# EAGLE design dhtsensor (EAGLE 6.1)
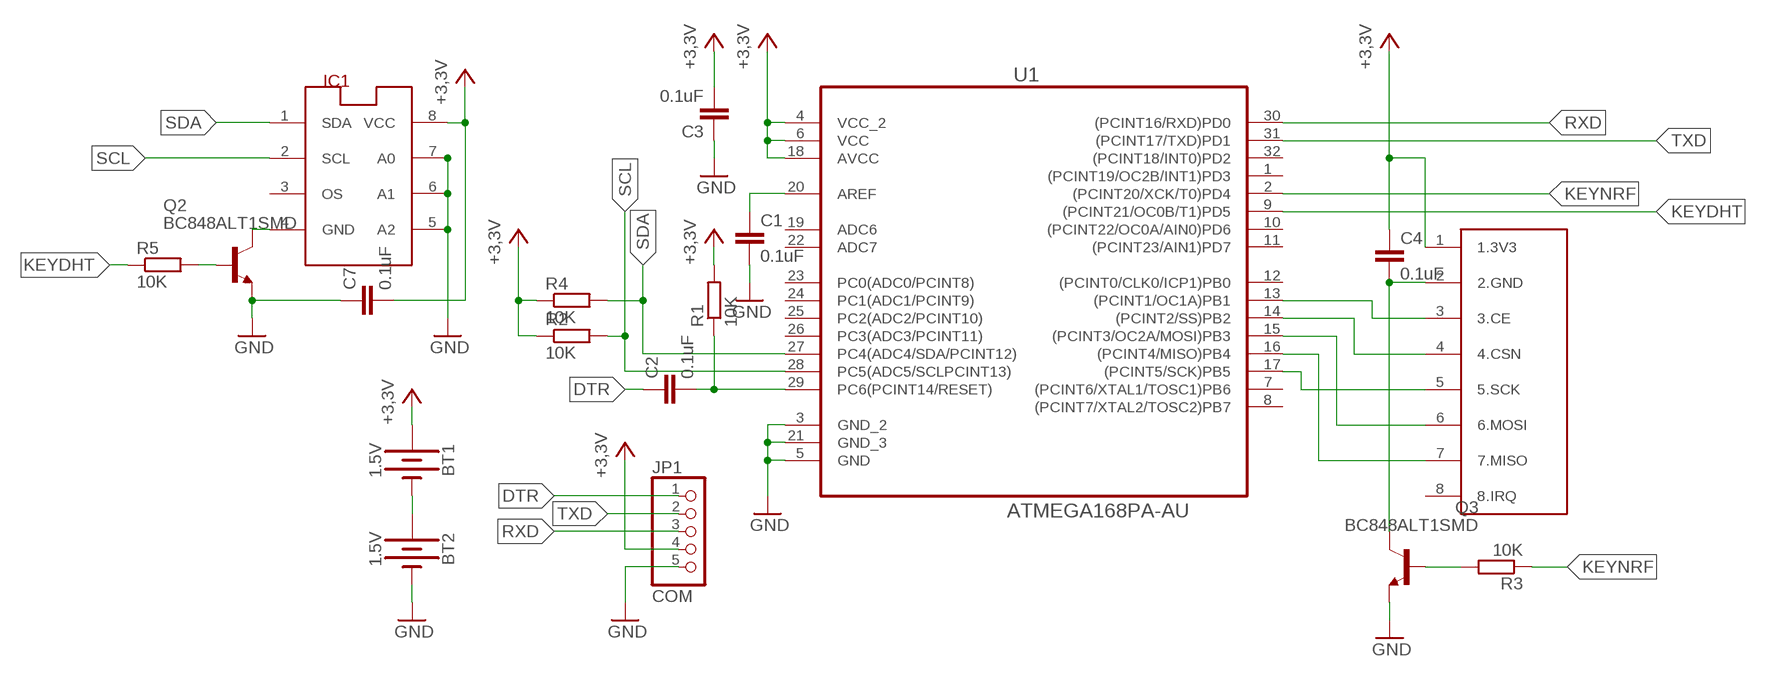
[diagram p0: schematic, sheet 1]

## Parts
BT1  1.5V  BATTERY-AAA_KIT  [BATTERY-AAA-KIT]
BT2  1.5V  BATTERY-AAA_KIT  [BATTERY-AAA-KIT]
C1  0.1uF  C-EUC1206  [C1206]
C2  0.1uF  C-EUC1206  [C1206]
C3  0.1uF  C-EUC1206  [C1206]
C4  0.1uF  C-EUC1206  [C1206]
C7  0.1uF  C-EUC1206  [C1206]
IC1  LM75_ICN  [SO8_LM75]
JP1  COM  PINHD-1X5  [1X05]
Q2  BC848ALT1SMD  [SOT23]
Q3  BC848ALT1SMD  [SOT23]
R1  10K  R-EU_R1206  [R1206]
R2  10K  R-EU_R1206  [R1206]
R3  10K  R-EU_R1206  [R1206]
R4  10K  R-EU_R1206  [R1206]
R5  10K  R-EU_R1206  [R1206]
U1  ATMEGA168PA-AU  [QFP80P900X900X120-32N]
U$9  NRF24L01+  [NRF24L01+]

## Nets
+3,3V: BT1.PWR@1(+) C3.2 C4.1 C7.2 IC1.8(VCC) JP1.4 R1.2 R2.1 R4.1 U1.4(VCC_2) U1.6(VCC) U1.18(AVCC) U$9.1(1.3V3)
DTR: C2.1 JP1.1
GND: BT2.GND@1(-) C1.2 C3.1 C7.1 IC1.5(A2) IC1.6(A1) IC1.7(A0) JP1.5 Q2.2(E) Q3.2(E) U1.3(GND_2) U1.5(GND) U1.21(GND_3)
KEYDHT: R5.1 U1.9((PCINT21/OC0B/T1)PD5)
KEYNRF: R3.1 U1.2((PCINT20/XCK/T0)PD4)
N$1: C2.2 R1.1 U1.29(PC6(PCINT14/RESET))
N$2: C1.1 U1.20(AREF)
N$3: U1.15((PCINT3/OC2A/MOSI)PB3) U$9.6(6.MOSI)
N$4: U1.16((PCINT4/MISO)PB4) U$9.7(7.MISO)
N$5: C4.2 Q3.3(C) U$9.2(2.GND)
N$6: BT1.GND@1(-) BT2.PWR@1(+)
N$7: U1.17((PCINT5/SCK)PB5) U$9.5(5.SCK)
N$8: U1.14((PCINT2/SS)PB2) U$9.4(4.CSN)
N$9: U1.13((PCINT1/OC1A)PB1) U$9.3(3.CE)
N$12: Q3.1(B) R3.2
N$13: IC1.4(GND) Q2.3(C)
N$14: Q2.1(B) R5.2
RXD: JP1.3 U1.30((PCINT16/RXD)PD0)
SCL: IC1.2(SCL) R2.2 U1.28(PC5(ADC5/SCLPCINT13))
SDA: IC1.1(SDA) R4.2 U1.27(PC4(ADC4/SDA/PCINT12))
TXD: JP1.2 U1.31((PCINT17/TXD)PD1)
Unconnected: IC1.3(OS) U1.1((PCINT19/OC2B/INT1)PD3) U1.7((PCINT6/XTAL1/TOSC1)PB6) U1.8((PCINT7/XTAL2/TOSC2)PB7) U1.10((PCINT22/OC0A/AIN0)PD6) U1.11((PCINT23/AIN1)PD7) U1.12((PCINT0/CLK0/ICP1)PB0) U1.19(ADC6) U1.22(ADC7) U1.23(PC0(ADC0/PCINT8)) U1.24(PC1(ADC1/PCINT9)) U1.25(PC2(ADC2/PCINT10)) U1.26(PC3(ADC3/PCINT11)) U1.32((PCINT18/INT0)PD2) U$9.8(8.IRQ)

## Library data of the parts
BT1 BT2 = SparkFun-Batteries:BATTERY: Battery - Single Cell A variety of battery chemistries, sizes, and footprints. Device List: 20MM_PTH - Coin Cell Battery Holder - 20mm (PTH) <https://www.sparkfun.com/products/783> 12MM_SMD - Coin Cell Battery Holder - 12mm (SMD) <https://www.sparkfun.com/products/10592> 12MM_PTH - Coin Cell Battery Holder - 12mm (PTH) <https://www.sparkfun.com/products/7948> 20MM_SMD - 20mm Coin Cell Battery Holder (SMD) (2 legs) Used on the Big Time Watch Kit <https://www.sparkfun.com/products/11734> 20MM_SMD_4LEGS - Coin Cell Battery Holder - 20mm (SMD) <https://www.sparkfun.com/products/11892> 20MM_SMD_4LEGS_OVERPASTE - Coin Cell Battery Holder - 20mm (SMD) <https://www.sparkfun.com/products/11892> (Over-paste on the legs) 24.5MM_PTH - Coin Cell Battery Holder - 24.5mm (PTH) <https://www.sparkfun.com/products/8863> 9V - 9V Battery Holder - PC Mount Used on the SparkFun SparkPunk Sound Kit <https://www.sparkfun.com/products/11177> and SparkFun SparkPunk Sequencer Kit <https://www.sparkfun.com/products/12707> 18650 - Battery Holder - 18650 (PTH) <https://www.sparkfun.com/products/13113> AA - Battery Holder - 1xAA (PTH) <https://www.sparkfun.com/products/7949> AAA - Battery Holder - 1xAAA (PTH) <https://www.sparkfun.com/products/12718> AA_KIT - Battery Holder - 1xAA (PTH) <https://www.sparkfun.com/products/7949> Special kit package - pads only have exposed copper on one side of the board. AAA_KIT - Battery Holder - 1xAAA (PTH) <https://www.sparkfun.com/products/12718> Special kit package - pads only have exposed copper on one side of the board.; PROD_ID: BATT-08571; SF_SKU: PRT-12718
C1-C4 C7 = resistor:C-EU: CAPACITOR, European symbol
IC1 = lm75:LM75_IC: Temperatursensor
JP1 = pinhead:PINHD-1X5: PIN HEADER
Q2 Q3 = transistor-npn:BC848*: NPN Transistor
R1-R5 = resistor:R-EU_: RESISTOR, European symbol
U1 = ATMEGA168PA-AU:ATMEGA168PA-AU: 8-bit Microcontroller; AVAILABILITY: Good; DESCRIPTION: ATmega Series 20 MHz 16 KB Flash 1 KB SRAM 8-Bit Microcontroller - TQFP-32; MF: Atmel; MP: ATMEGA168PA-AU; PACKAGE: TQFP-32 Atmel; PRICE: 2.36 USD
U$9 = NRF24l01+:NRF24L01+

## Board
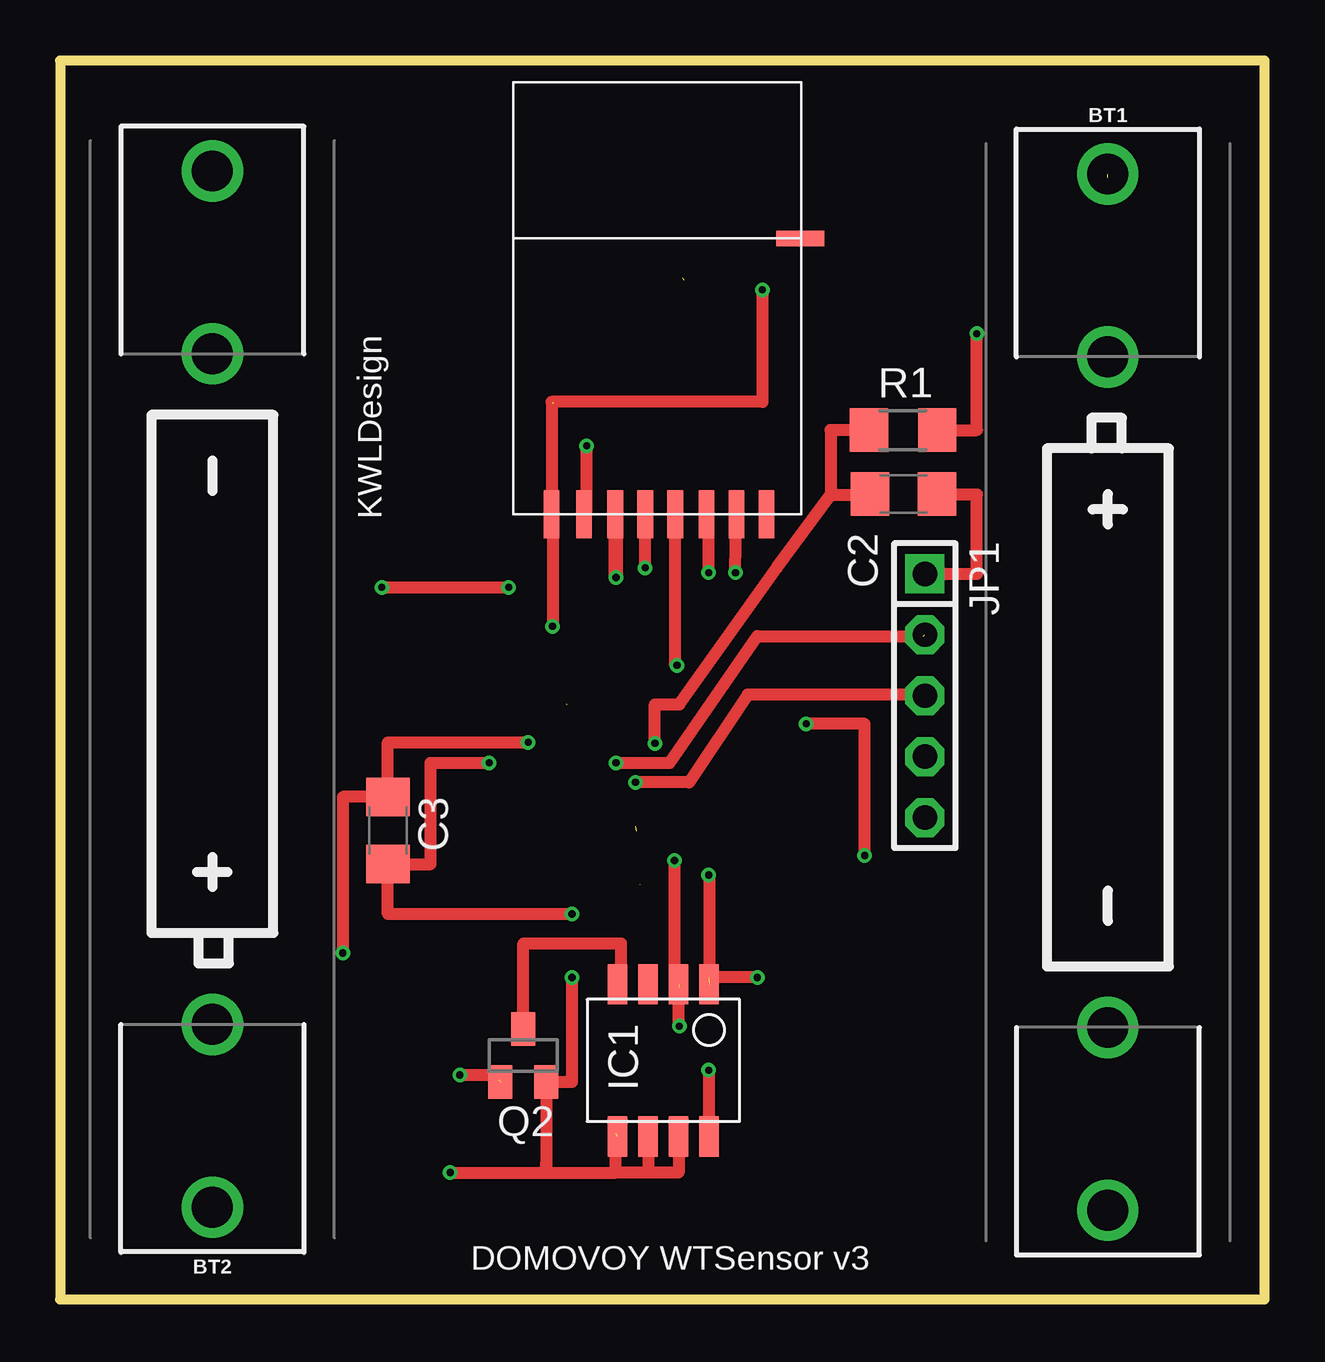
[diagram p1: board, top side]
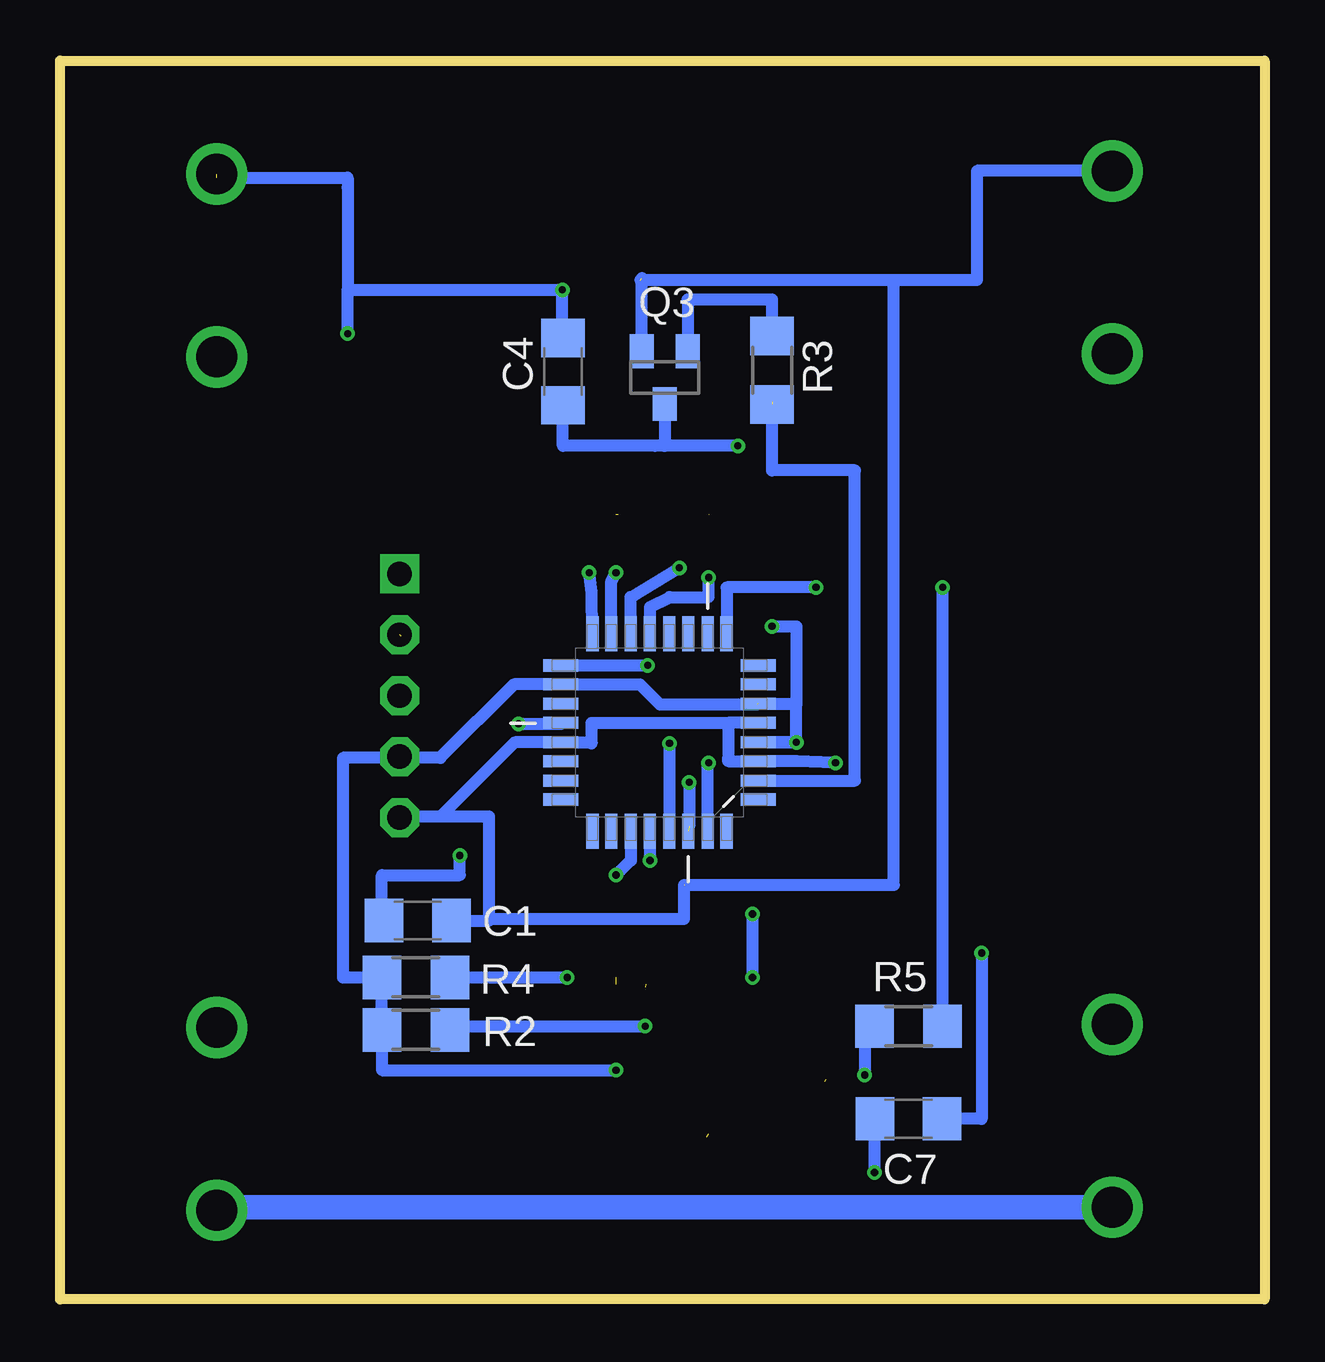
[diagram p2: board, bottom side, seen from below]

Size 50.19 x 51.74 mm. Coordinates in mm from the lower left corner, seen from the top.
Outline: 0,51.71 0,51.74 50.15,51.74 50.15,0 0,0 0,51.71
Outline: 0,51.71 0,0.1 50.19,0.1 50.19,51.71 0,51.71
Copper layers (1*16): Top 0.035mm / dielectric 1.5mm / Bottom 0.035mm
Design rules: minimum track width 6mil, minimum drill 0.3mm, track to track 6mil, track to pad 6mil, pad to pad 6mil, via to via 6mil, smd to smd 6mil, copper to edge 32mil, drill to drill 32mil, minimum pad ring 12mil, minimum via ring 6mil, stop-mask expansion 4mil, vias tented up to drill 0mil, thermal gap 10mil

### Footprints (pad centres in the part's own frame; a part is rotated, then mirrored left to right if it is on the bottom)
BATTERY-AAA-KIT = drill 1.702: GND@1 21.59,0; GND@2 13.97,0; PWR@1 -21.59,0; PWR@2 -13.97,0
C1206 = smd 1.6 x 1.8: 1 -1.4,0; 2 1.4,0
SO8_LM75 = smd 0.813 x 1.676: 1 -1.27,-3.175; 2 0,-3.175; 3 1.27,-3.175; 4 2.54,-3.175; 5 2.54,3.175; 6 1.27,3.175; 7 0,3.175; 8 -1.27,3.175
1X05 = drill 1.016 square: 1 -5.08,0 | drill 1.016 octagon: 2 -2.54,0; 3 0,0; 4 2.54,0; 5 5.08,0
SOT23 = smd 1 x 1.4: 1 -0.95,-1.1; 2 0.95,-1.1; 3 0,1.1
R1206 = smd 1.6 x 1.803: 1 -1.422,0; 2 1.422,0
QFP80P900X900X120-32N = smd 1.473 x 0.508: 1 -4.115,2.794; 2 -4.115,2.007; 3 -4.115,1.194; 4 -4.115,0.406; 5 -4.115,-0.406; 6 -4.115,-1.194; 7 -4.115,-2.007; 8 -4.115,-2.794; 17 4.115,-2.794; 18 4.115,-2.007; 19 4.115,-1.194; 20 4.115,-0.406; 21 4.115,0.406; 22 4.115,1.194; 23 4.115,2.007; 24 4.115,2.794 | smd 0.508 x 1.473: 9 -2.794,-4.115; 10 -2.007,-4.115; 11 -1.194,-4.115; 12 -0.406,-4.115; 13 0.406,-4.115; 14 1.194,-4.115; 15 2.007,-4.115; 16 2.794,-4.115; 25 2.794,4.115; 26 2.007,4.115; 27 1.194,4.115; 28 0.406,4.115; 29 -0.406,4.115; 30 -1.194,4.115; 31 -2.007,4.115; 32 -2.794,4.115
NRF24L01+ = smd 0.65 x 2: 1 1.6,0; 2 2.95,0; 3 4.25,0; 4 5.5,0; 5 6.75,0; 6 8.05,0; 7 9.3,0; 8 10.55,0 | smd 2 x 0.65: 9 11.96,11.49

### Placement (x,y rotation side)
BT1  43.66,25.4 270 top
BT2  6.35,25.53 90 top
C1  35.28,15.88 0 bottom
C2  35.14,33.65 180 top
C3  13.67,19.63 90 top
C4  29.24,38.76 270 bottom
C7  14.83,7.62 0 bottom
IC1  25.77,10.06 180 top
JP1  36.04,25.25 270 top
Q2  19.3,10.26 0 top
Q3  24.99,38.51 180 bottom
R1  35.13,36.32 0 top
R2  35.36,11.33 0 bottom
R3  20.52,38.81 90 bottom
R4  35.36,13.51 0 bottom
R5  14.83,11.48 180 bottom
U1  25.21,23.72 180 bottom
U$9  18.89,32.82 0 top

### Tracks (layer width: path | path; a pad name or v marks a point on that pad's centre or on a via)
+3,3V  (via drill 0.3)  (2 unrouted)
  Top 0.508: v20.52,28.14 20.52,32.82 U$9.1 20.49,37.49 29.26,37.49 v29.26,42.16 | R1.2 37.19,36.32 38.2,36.32 v38.2,40.34 | v27.03,9.65 27.03,6.88 IC1.8 | v19.51,23.31 13.66,23.31 C3.2 11.79,21.03 v11.79,14.53
  Bottom 0.508: v19.51,23.31 U1.4 v19.51,23.31 | v19.51,23.31 19.51,24.89 | 19.51,24.89 21.13,24.89 25.2,24.89 26.03,25.73 U1.18 31.27,25.73 34.34,22.66 35.98,22.66 | v20.52,28.14 19.51,28.14 19.51,24.89 | C4.1 29.26,40.16 v29.26,42.16 38.2,42.16 | 43.66,46.84 38.2,46.84 38.2,46.43 38.2,42.16 | v38.2,40.34 38.2,42.16 | 35.98,22.66 JP1.4 | 35.98,22.66 38.41,22.66 38.41,13.51 R4.1 R2.1 36.78,9.65 v27.03,9.65 | v11.79,14.53 11.79,7.62 C7.2
DTR
  Top 0.508: JP1.1 38.2,30.33 38.2,33.63 36.54,33.63 C2.1
GND  (via drill 0.3)  (3 unrouted)
  Top 0.508: 20.25,5.79 Q2.2 21.34,9.16 v21.34,13.51 | 20.25,5.79 20.25,5.39 | 20.25,5.39 23.16,5.39 | 23.16,5.39 23.16,7.01 | IC1.6 24.5,5.39 | 24.5,5.39 23.16,5.39 | IC1.7 25.77,5.39 24.5,5.39 | v17.88,22.45 15.44,22.45 15.44,18.23 C3.1 13.66,16.15 v21.34,16.15 | v16.26,5.39 20.25,5.39 | 20.25,5.39 20.25,5.79
  Bottom 0.508: U1.5 22.35,24.12 | 22.35,24.12 22.35,22.66 22.35,22.52 U1.3 19.51,22.52 v17.88,22.45 | 34.34,20.22 31.25,23.31 U1.21 28.04,23.31 28.04,23.27 28.04,24.12 22.35,24.12 | 34.34,20.22 35.99,20.22 JP1.5 | C1.2 32.31,15.88 32.31,15.95 | 32.31,15.95 32.31,20.22 34.34,20.22 | Q3.2 25.94,42.65 | C7.1 16.26,7.62 v16.26,5.39 | v21.34,13.51 v21.34,16.15 | BT2.GND@1 11.99,47.12 11.99,42.57 15.44,42.57 | 15.44,42.57 26.01,42.57 | 32.31,15.95 24.18,15.95 24.18,17.37 | 24.16,17.37 15.44,17.37 15.44,42.57
KEYDHT  (via drill 0.3)
  Top 0.508: v13.41,29.77 v18.69,29.77
  Bottom 0.508: R5.1 v13.41,29.77 | v18.69,29.77 22.42,29.77 U1.9
KEYNRF  (1 unrouted)
  Bottom 0.508: U1.2 17.07,21.71 17.07,34.65 20.52,34.65 20.52,37.49
N$1  (via drill 0.3)
  Top 0.508: R1.1 32.11,36.32 32.11,33.63 | 32.11,33.63 33.74,33.63 C2.2 | v24.79,23.27 24.79,24.89 25.81,24.89 29.87,30.58 32.11,33.63
  Bottom 0.508: U1.29 v24.79,23.27
N$2  (via drill 0.3)
  Top 0.508: v33.53,18.59 33.53,24.08 v31.09,24.08
  Bottom 0.508: C1.1 36.78,15.88 36.78,17.78 33.53,17.78 v33.53,18.59 | v31.09,24.08 29.33,24.08 U1.20
N$3  (via drill 0.3)  (1 unrouted)
  Top 0.508: v27.03,30.38 27.03,32.82
  Bottom 0.508: U1.15 27.23,29.97 v27.03,30.38
N$4  (via drill 0.3)
  Top 0.508: v28.14,30.38 U$9.7
  Bottom 0.508: U1.16 28.04,29.57 v28.14,30.38
N$5  (via drill 0.3)
  Top 0.508: U$9.2 21.95,32.82 v21.95,35.66
  Bottom 0.508: Q3.3 24.99,35.66 25.4,35.66 | 25.4,35.66 29.24,35.66 C4.2 | v21.95,35.66 25.4,35.66
N$6
  Bottom 1.016: BT2.PWR@1 43.05,3.94 BT1.GND@1
N$7  (via drill 0.3)
  Top 0.508: v25.7,26.52 25.64,26.52 U$9.5
  Bottom 0.508: U1.17 25.81,26.51 v25.7,26.52
N$8  (via drill 0.3)
  Top 0.508: v24.38,30.58 U$9.4
  Bottom 0.508: U1.14 26.42,29.36 v24.38,30.58
N$9  (via drill 0.3)  (1 unrouted)
  Top 0.61: v23.16,30.18 23.16,32.82
  Bottom 0.406: U1.13 25.6,27.83
  Bottom 0.508: 25.6,27.83 25.6,28.96 24.79,29.36 23.16,29.36 v23.16,30.18
N$12
  Bottom 0.508: R3.2 20.52,41.76 24.04,41.76 Q3.1
N$13
  Top 0.508: Q2.3 19.3,14.94 23.37,14.94 23.37,13.23 IC1.4
N$14  (via drill 0.3)  (1 unrouted)
  Top 0.508: v16.66,9.45 18.29,9.45 18.29,9.25
  Bottom 0.508: R5.2 16.66,11.48 v16.66,9.45
RXD  (via drill 0.3)  (1 unrouted)
  Top 0.508: JP1.3 36.04,25.3 28.65,25.3 26.21,21.64 v23.98,21.64
  Bottom 0.508: v23.98,21.64 23.98,19.81
SCL  (via drill 0.3)  (1 unrouted)
  Top 0.508: v25.6,18.39 25.6,13.11 25.81,13.11 | v25.81,11.48 25.77,11.65 IC1.2
  Bottom 0.508: U1.28 25.62,18.39 v25.6,18.39 | R2.2 33.78,11.48 v25.81,11.48
SDA  (via drill 0.3)  (1 unrouted)
  Top 0.508: v27.03,17.78 27.04,17.76 IC1.1 | v29.06,13.51 27.03,13.51
  Bottom 0.508: U1.27 26.41,18.39 26.42,18.39 v27.03,17.78 | R4.2 v29.06,13.51
TXD  (via drill 0.3)  (1 unrouted)
  Top 0.508: v23.16,22.45 25.4,22.45 29.06,27.74 35.97,27.74
  Bottom 0.508: U1.31 23.2,22.45 v23.16,22.45

### Text on the board
tNames: KWLDesign | DOMOVOY WTSensor v3